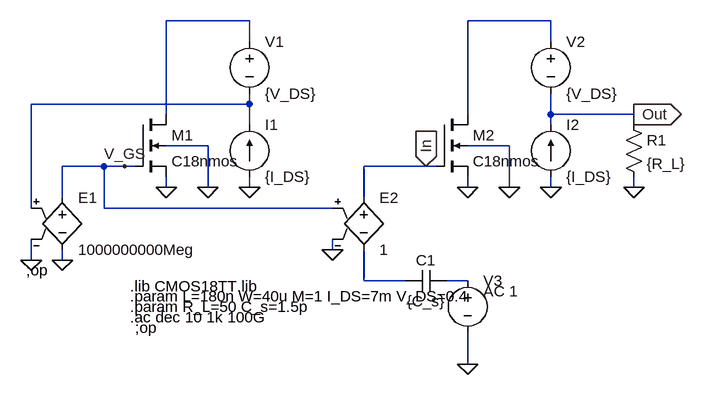
[diagram p0: schematic CSstage_Vs.asc]
CSstage_Vs.asc, the LTspice schematic file:
Version 4
SHEET 1 900 680
WIRE -80 -544 -208 -544
WIRE 384 -544 256 -544
WIRE -80 -512 -80 -544
WIRE 384 -512 384 -544
WIRE -80 -416 -80 -432
WIRE -80 -416 -416 -416
WIRE -208 -400 -208 -544
WIRE 256 -400 256 -544
WIRE 384 -400 384 -432
WIRE 512 -400 384 -400
WIRE -80 -384 -80 -416
WIRE 384 -384 384 -400
WIRE 512 -384 512 -400
WIRE -144 -352 -208 -352
WIRE 320 -352 256 -352
WIRE -304 -320 -368 -320
WIRE -272 -320 -304 -320
WIRE -256 -320 -272 -320
WIRE 192 -320 96 -320
WIRE 208 -320 192 -320
WIRE -208 -288 -208 -304
WIRE -144 -288 -144 -352
WIRE -80 -288 -80 -304
WIRE 256 -288 256 -304
WIRE 320 -288 320 -352
WIRE 384 -288 384 -304
WIRE 512 -288 512 -304
WIRE -368 -272 -368 -320
WIRE 96 -272 96 -320
WIRE -416 -256 -416 -416
WIRE -304 -256 -304 -320
WIRE 48 -256 -304 -256
WIRE 48 -192 48 -208
WIRE -416 -176 -416 -208
WIRE -368 -176 -368 -192
WIRE 96 -144 96 -192
WIRE 160 -144 96 -144
WIRE 256 -144 224 -144
WIRE 256 -16 256 -64
FLAG -144 -288 0
FLAG -208 -288 0
FLAG -368 -176 0
FLAG -80 -288 0
FLAG -416 -176 0
FLAG -272 -320 V_GS
FLAG 320 -288 0
FLAG 256 -288 0
FLAG 384 -288 0
FLAG 48 -192 0
FLAG 512 -288 0
FLAG 256 -16 0
FLAG 512 -400 Out
IOPIN 512 -400 Out
FLAG 192 -320 In
IOPIN 192 -320 In
DATAFLAG -416 -416 ""
DATAFLAG -352 -320 ""
DATAFLAG 112 -320 ""
DATAFLAG 496 -400 ""
DATAFLAG 144 -144 ""
SYMBOL nmos4 -256 -400 R0
SYMATTR InstName M1
SYMATTR Value C18nmos
SYMATTR Value2 l={L} w={W} m={m}
SYMBOL e -368 -288 R0
SYMATTR InstName E1
SYMATTR Value 1000000000Meg
SYMBOL voltage -80 -528 R0
SYMATTR InstName V1
SYMATTR Value {V_DS}
SYMBOL current -80 -304 M180
WINDOW 0 24 80 Left 2
WINDOW 3 24 0 Left 2
SYMATTR InstName I1
SYMATTR Value {I_DS}
SYMBOL nmos4 208 -400 R0
SYMATTR InstName M2
SYMATTR Value C18nmos
SYMATTR Value2 l={L} w={W} ad={w*500n} as={w*500n} pd={2*w+1u} ps={2*w+1u} m={m}
SYMBOL e 96 -288 R0
SYMATTR InstName E2
SYMATTR Value 1
SYMBOL voltage 384 -528 R0
SYMATTR InstName V2
SYMATTR Value {V_DS}
SYMBOL current 384 -304 M180
WINDOW 0 24 80 Left 2
WINDOW 3 24 0 Left 2
SYMATTR InstName I2
SYMATTR Value {I_DS}
SYMBOL res 496 -400 R0
SYMATTR InstName R1
SYMATTR Value {R_L}
SYMBOL voltage 256 -160 R0
WINDOW 123 24 32 Left 2
WINDOW 39 0 0 Left 0
SYMATTR Value2 AC 1
SYMATTR InstName V3
SYMATTR Value ""
SYMBOL cap 224 -160 R90
WINDOW 0 0 32 VBottom 2
WINDOW 3 32 32 VTop 2
SYMATTR InstName C1
SYMATTR Value {C_s}
TEXT -264 -120 Left 2 !.param L=180n W=40u M=1 I_DS=7m V_DS=0.4
TEXT -424 -160 Left 2 !;op
TEXT -264 -136 Left 2 !.lib CMOS18TT.lib
TEXT -256 -72 Left 2 !;op
TEXT -264 -104 Left 2 !.param R_L=50 C_s=1.5p
TEXT -264 -88 Left 2 !.ac dec 10 1k 100G

The netlist it stands for:
* CSstage_Vs.asc
M1 N001 V_GS 0 0 C18nmos l={L} w={W} m={m}
E1 V_GS 0 N003 0 1000000000Meg
V1 N001 N003 {V_DS}
I1 0 N003 {I_DS}
M2 N002 In 0 0 C18nmos l={L} w={W} ad={w*500n} as={w*500n} pd={2*w+1u} ps={2*w+1u} m={m}
E2 In N004 V_GS 0 1
V2 N002 Out {V_DS}
I2 0 Out {I_DS}
R1 Out 0 {R_L}
V3 N005 0 AC 1
C1 N005 N004 {C_s}
.model NMOS NMOS
.model PMOS PMOS
.lib standard.mos
.param L=180n W=40u M=1 I_DS=7m V_DS=0.4
;op
.lib CMOS18TT.lib
;op
.param R_L=50 C_s=1.5p
.ac dec 10 1k 100G
.backanno
.end